# Altium schematic sheet LIS2.SchDoc: Top Level
size A3; CompanyName: NOT USED; DocumentNumber: 3; SheetNumber: 3; SheetTotal: 10; PageSetup: Record=PageOptions|CenterHorizontal=True|CenterVertical=True|PrintScale=1.00|XCorrection=1.00|YCorrection=1.00|PrintKind=0|BorderSize=5000000|LeftOffset=0|BottomOffset=0|Orientation=2|PaperLength=1000|PaperWidth=1000|Scale=100|PaperSource=7|PrintQuality=-4|MediaType=1|DitherType=10|PaperKind=A3|PrintScaleMode=0
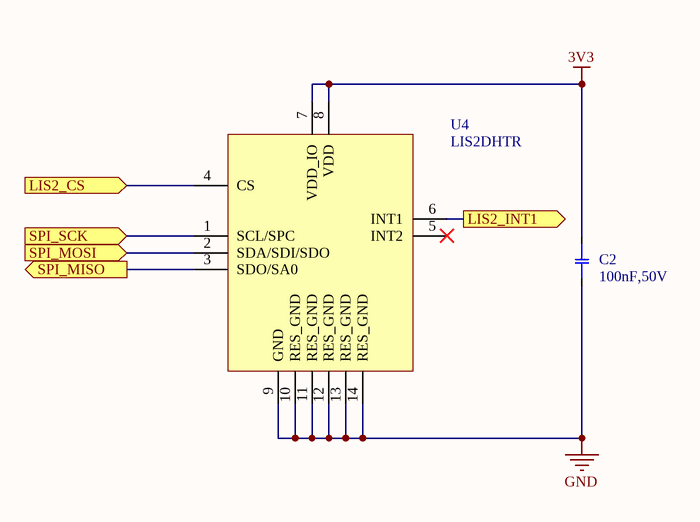
[diagram p0: LIS2.SchDoc]

## Parts
C2  100nF,50V  [CAPC1608X09N_0603]
U4  LIS2DHTR  [PQFN35P200X200X100-14N]

## Ports
LIS2_CS (in), LIS2_INT1 (out), SPI_MISO (out), SPI_MOSI (in), SPI_SCK (in)

## Nets
3V3: C2.2 U4.7(VDD_IO) U4.8(VDD)
GND: C2.1 U4.9(GND) U4.10(RES_GND) U4.11(RES_GND) U4.12(RES_GND) U4.13(RES_GND) U4.14(RES_GND)
LIS2_CS: U4.4(CS) ; port LIS2_CS
LIS2_INT1: U4.6(INT1) ; port LIS2_INT1
SPI_MISO: U4.3(SDO/SA0) ; port SPI_MISO
SPI_MOSI: U4.2(SDA/SDI/SDO) ; port SPI_MOSI
SPI_SCK: U4.1(SCL/SPC) ; port SPI_SCK

Not connected (* = marked no-connect by the designer): U4 5(INT2)*

## Notes on the sheet
- Project
- Size:
- Date:
- A3
- Revision:
- Sheet
- of
- Lambo
- File:

## Library data of the parts
C2 = CCH-104CH-G: CAP CER 0.1UF 50V 10% X7R 0603; Manufacturer: Kemet; Manufacturer Part Number: C0603C104K5RACTU; Type: Ceramic; Display_Name: 100nF,50V; Capacitance: 100nF; Dielectric: X7R; Tolerance: 10%; Voltage: 50V; BWA PN: CCH-104CH-G; Schematic Symbol: CAP-NP_1; Supplier 1: Digi-Key; Supplier Part Number 1: 399-5089-1-ND
U4 = ICT-10655-A: IC ACCELEROMETER I2C/SPI 14-LGA; Manufacturer: STMicroelectronics; Temp Range: -40°C ~ 85°C; Display_Name: LIS2DHTR; BWA PN: ICT-10655-A; Schematic Symbol: LIS2DHTR; Manufacturer Part Number: LIS2DHTR; Supplier 1: Digi-Key; Supplier Part Number 1: 497-13795-1-ND